# Altium schematic sheet AudioCodec.SchDoc: Audio Codec
size Letter; DocumentNumber: 6; Revision: 1; SheetNumber: 6; SheetTotal: 6
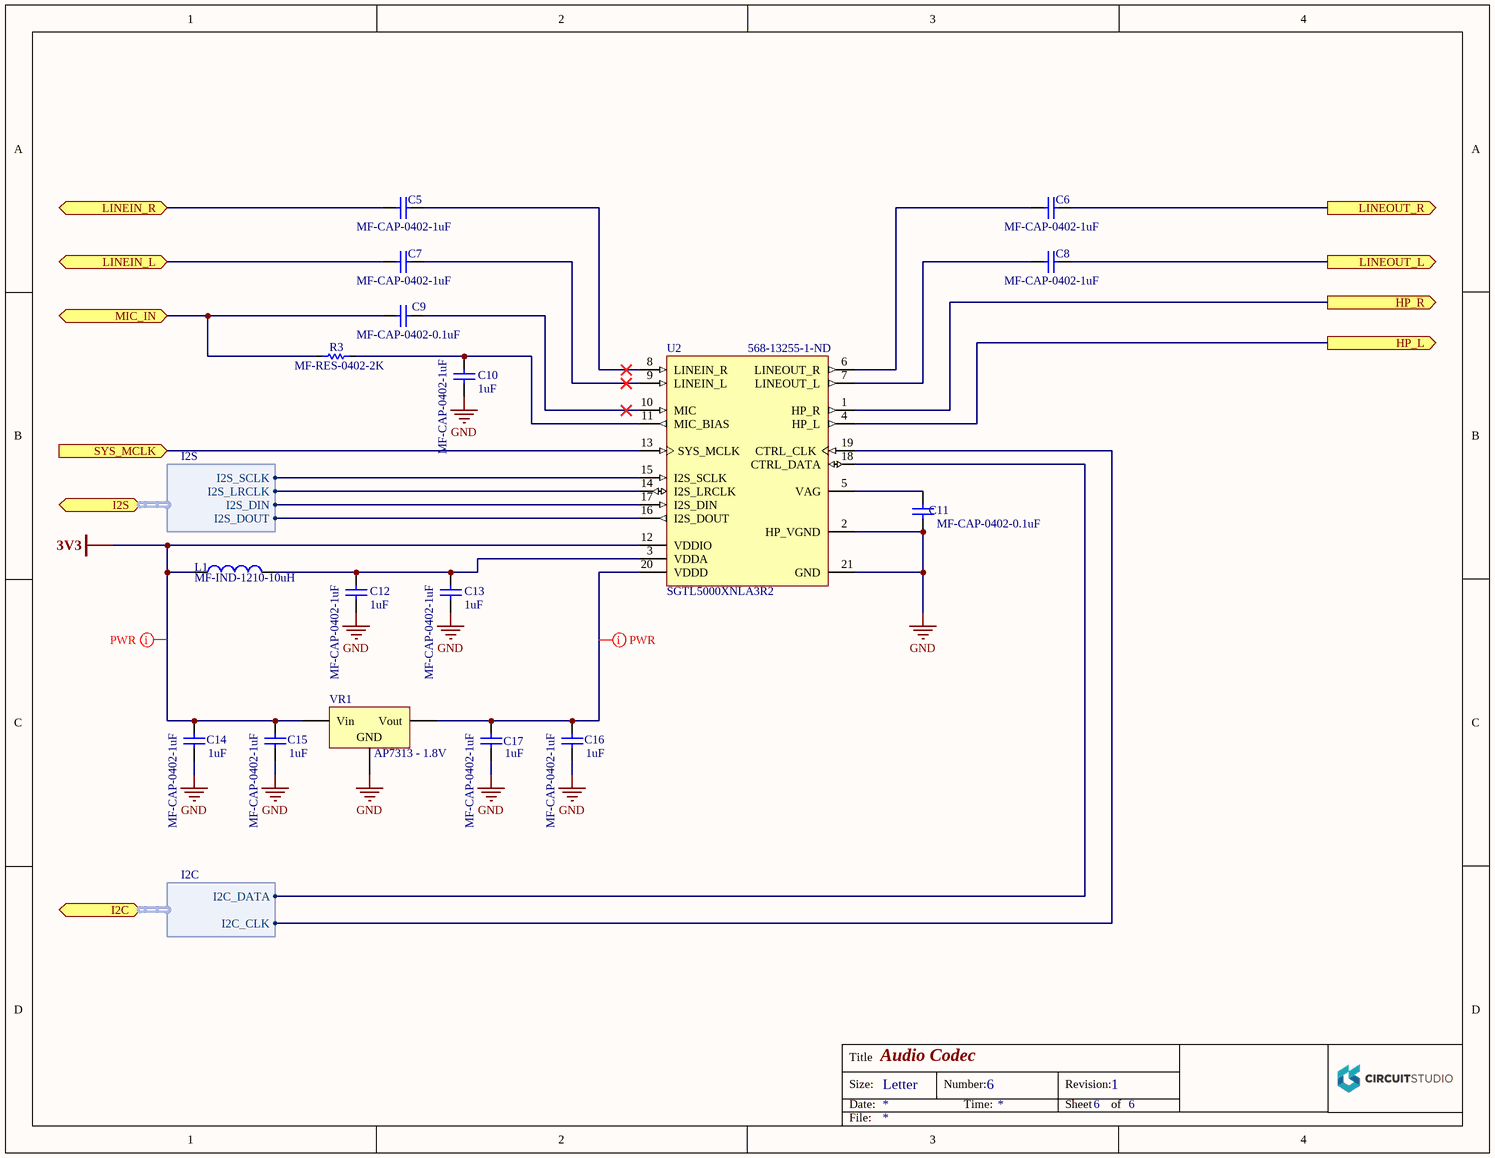
[diagram p0: AudioCodec.SchDoc]

## Parts
C5  MF-CAP-0402-1uF  [C0402N]
C6  MF-CAP-0402-1uF  [C0402N]
C7  MF-CAP-0402-1uF  [C0402N]
C8  MF-CAP-0402-1uF  [C0402N]
C9  MF-CAP-0402-0.1uF  [C0402N]
C10  MF-CAP-0402-1uF  Capacitance: 1uF  [C0402N]
C11  MF-CAP-0402-0.1uF  [C0402N]
C12  MF-CAP-0402-1uF  Capacitance: 1uF  [C0402N]
C13  MF-CAP-0402-1uF  Capacitance: 1uF  [C0402N]
C14  MF-CAP-0402-1uF  Capacitance: 1uF  [C0402N]
C15  MF-CAP-0402-1uF  Capacitance: 1uF  [C0402N]
C16  MF-CAP-0402-1uF  Capacitance: 1uF  [C0402N]
C17  MF-CAP-0402-1uF  Capacitance: 1uF  [C0402N]
L1  MF-IND-1210-10uH  [L1210_N]
R3  MF-RES-0402-2K  [R0402L]
U2  SGTL5000XNLA3R2  Supplier Part Number 1: 568-13255-1-ND  [FRES-2032-01_L]
VR1  AP7313 - 1.8V  [AP7313_L]

## Ports
HP_L (out), HP_R (out), I2C (harness I2C), I2S (harness I2S), LINEIN_L, LINEIN_R, LINEOUT_L (out), LINEOUT_R (out), MIC_IN, SYS_MCLK (in)

## Harnesses
I2S: I2S_SCLK, I2S_LRCLK, I2S_DIN, I2S_DOUT
I2C: I2C_CLK, I2C_DATA

## Nets
3V3: C14.1 C15.1 L1.1 U2.12(VDDIO) VR1.1(Vin)
GND: C10.2 C11.2 C12.2 C13.2 C14.2 C15.2 C16.2 C17.2 U2.2(HP_VGND) U2.21(GND) VR1.3(GND)
HP_L: U2.4(HP_L) ; port HP_L
HP_R: U2.1(HP_R) ; port HP_R
LINEIN_L: C7.2 ; port LINEIN_L
LINEIN_R: C5.2 ; port LINEIN_R
LINEOUT_L: C8.1 ; port LINEOUT_L
LINEOUT_R: C6.1 ; port LINEOUT_R
MIC_IN: C9.2 R3.1 ; port MIC_IN
SYS_MCLK: U2.13(SYS_MCLK) ; port SYS_MCLK
NetC5_1: C5.1 U2.8(LINEIN_R)
NetC6_2: C6.2 U2.6(LINEOUT_R)
NetC7_1: C7.1 U2.9(LINEIN_L)
NetC8_2: C8.2 U2.7(LINEOUT_L)
NetC9_1: C9.1 U2.10(MIC)
NetC10_1: C10.1 R3.2 U2.11(MIC_BIAS)
NetC11_1: C11.1 U2.5(VAG)
NetC12_1: C12.1 C13.1 L1.2 U2.3(VDDA)
NetC16_1: C16.1 C17.1 U2.20(VDDD) VR1.2(Vout)
NetU2_14: U2.14(I2S_LRCLK) ; port I2S.I2S_LRCLK
NetU2_15: U2.15(I2S_SCLK) ; port I2S.I2S_SCLK
NetU2_16: U2.16(I2S_DOUT) ; port I2S.I2S_DOUT
NetU2_17: U2.17(I2S_DIN) ; port I2S.I2S_DIN
NetU2_18: U2.18(CTRL_DATA) ; port I2C.I2C_DATA
NetU2_19: U2.19(CTRL_CLK) ; port I2C.I2C_CLK

## Layout directives
net class PWR: 3V3, NetC16_1

## Notes on the sheet
- Title
- Size:
- Date:
- Letter
- Number:
- Time:
- Revision:
- Sheet
- of
- File:

## Library data of the parts
C5-C8 = CAPACITOR_NP: HOUSEPART: YES; POPULATE: 1; TOLERANCE: 10%; VOLTAGE: 16V; Capacitance: 1uF; LibraryName: MF_Passives; DeviceSetName: CAPACITOR_NP; MF_PARTNUM: MF-CAP-0402-1uF; Supplier 1: Digi-Key; Supplier Part Number 1: 490-10453-1-ND
C9 C11 = CAPACITOR_NP: HOUSEPART: YES; POPULATE: 1; TOLERANCE: 10%; VOLTAGE: 16V; Capacitance: 100nF; LibraryName: MF_Passives; DeviceSetName: CAPACITOR_NP; MF_PARTNUM: MF-CAP-0402-0.1uF; Supplier 1: Digi-Key; Supplier Part Number 1: 490-5415-1-ND
C10 C12-C17 = CAPACITOR_NP: HOUSEPART: YES; POPULATE: 1; LibraryName: MF_Passives; DeviceSetName: CAPACITOR_NP; MF_PARTNUM: MF-CAP-0402-1uF; Supplier 1: Digi-Key; Supplier Part Number 1: 490-10453-1-ND
L1 = INDUCTOR: HOUSEPART: YES; POPULATE: 1; LibraryName: MF_Passives; DeviceSetName: INDUCTOR; MF_PARTNUM: MF-IND-1210-10uH; Supplier 1: Digi-Key; Supplier Part Number 1: 732-4670-1-ND
R3 = RESISTOR: HOUSEPART: YES; POPULATE: 1; VOLTAGE: 50 V; WATTAGE: 100mW; VALUE: 2K; SymbolName_1: RESISTOR; LibraryName: MF_Passives; DeviceSetName: RESISTOR; MF_PARTNUM: MF-RES-0402-2K
U2 = CMP-1078-00004-1: Low Power Stereo Codec with Headphone Amp, 1.1 to 2 V, -40 to 85 degC, 20-Pin QFN-EP, RoHS, Tape and Reel; Manufacturer: Freescale Semiconductor; SYS_MCLK Rise/Fall Time: 0.5 to 10 ns; VDDD(V): 1.1 to 2; LINEOUT Output Impedance: 320 Ohm Typ.; VDDIO(V): 1.62 to 3.6; MIC Input Impedance: 2.9 KOhm Typ.; ComponentLink1Description: Manufacturer URL; ComponentLink2Description: Datasheet; Temperature Range: -40 to 85 degC; PartNumber: SGTL5000XNLA3R2; ComponentLink2URL: http://cache.freescale.com/files/analog/doc/data_sheet/SGTL5000.pdf?pspll=1&Parent_nodeId=1227651963351723867067&Parent_pageType=product; RoHS: TRUE; ComponentLink3URL: http://cache.freescale.com/files/shared/doc/package_info/98ARE10742D.pdf?&Parent_nodeId=&Parent_pageType=; ComponentLink1URL: http://www.freescale.com/; Mounting Technology: Surface Mount; ComponentLink3Description: Package Specification; PackageDescription: 20-Pin Thermally Enhanced Quad Flat Non-Lead Package(QFN), Body 3 x 3 mm, Pitch 0.4 mm; Packing: Tape and Reel; DatasheetVersion: Rev. 6.0; PackageVersion: Rev. O; PackageReference: 2032-01; Supplier 1: Digi-Key
VR1 = Volt Reg: Voltage Regulator; Input Voltage: 2V to 6V; Output Voltage: 1V to 3.3V Fixed; Startup Time: 80uS; Current - Output: 150mA; Dropout Voltage: 150mV; Current - Quiescent (Iq): 75µA; PSRR: 65dB (100Hz); Protection Features: Over Current, Over Temperature, Short Circuit; PackageDescription: 3-Pin Transistor Outline Package 2.54 mm Pitch, 15.1 mm Lead Span; Package: SOT23; Operating Temperature: -40°C ~ 85°C; Supplier 1: Digi-Key; Supplier Part Number 1: AP7313-18SAG-7DICT-ND